# EAGLE design otl (EAGLE 7.7.0)
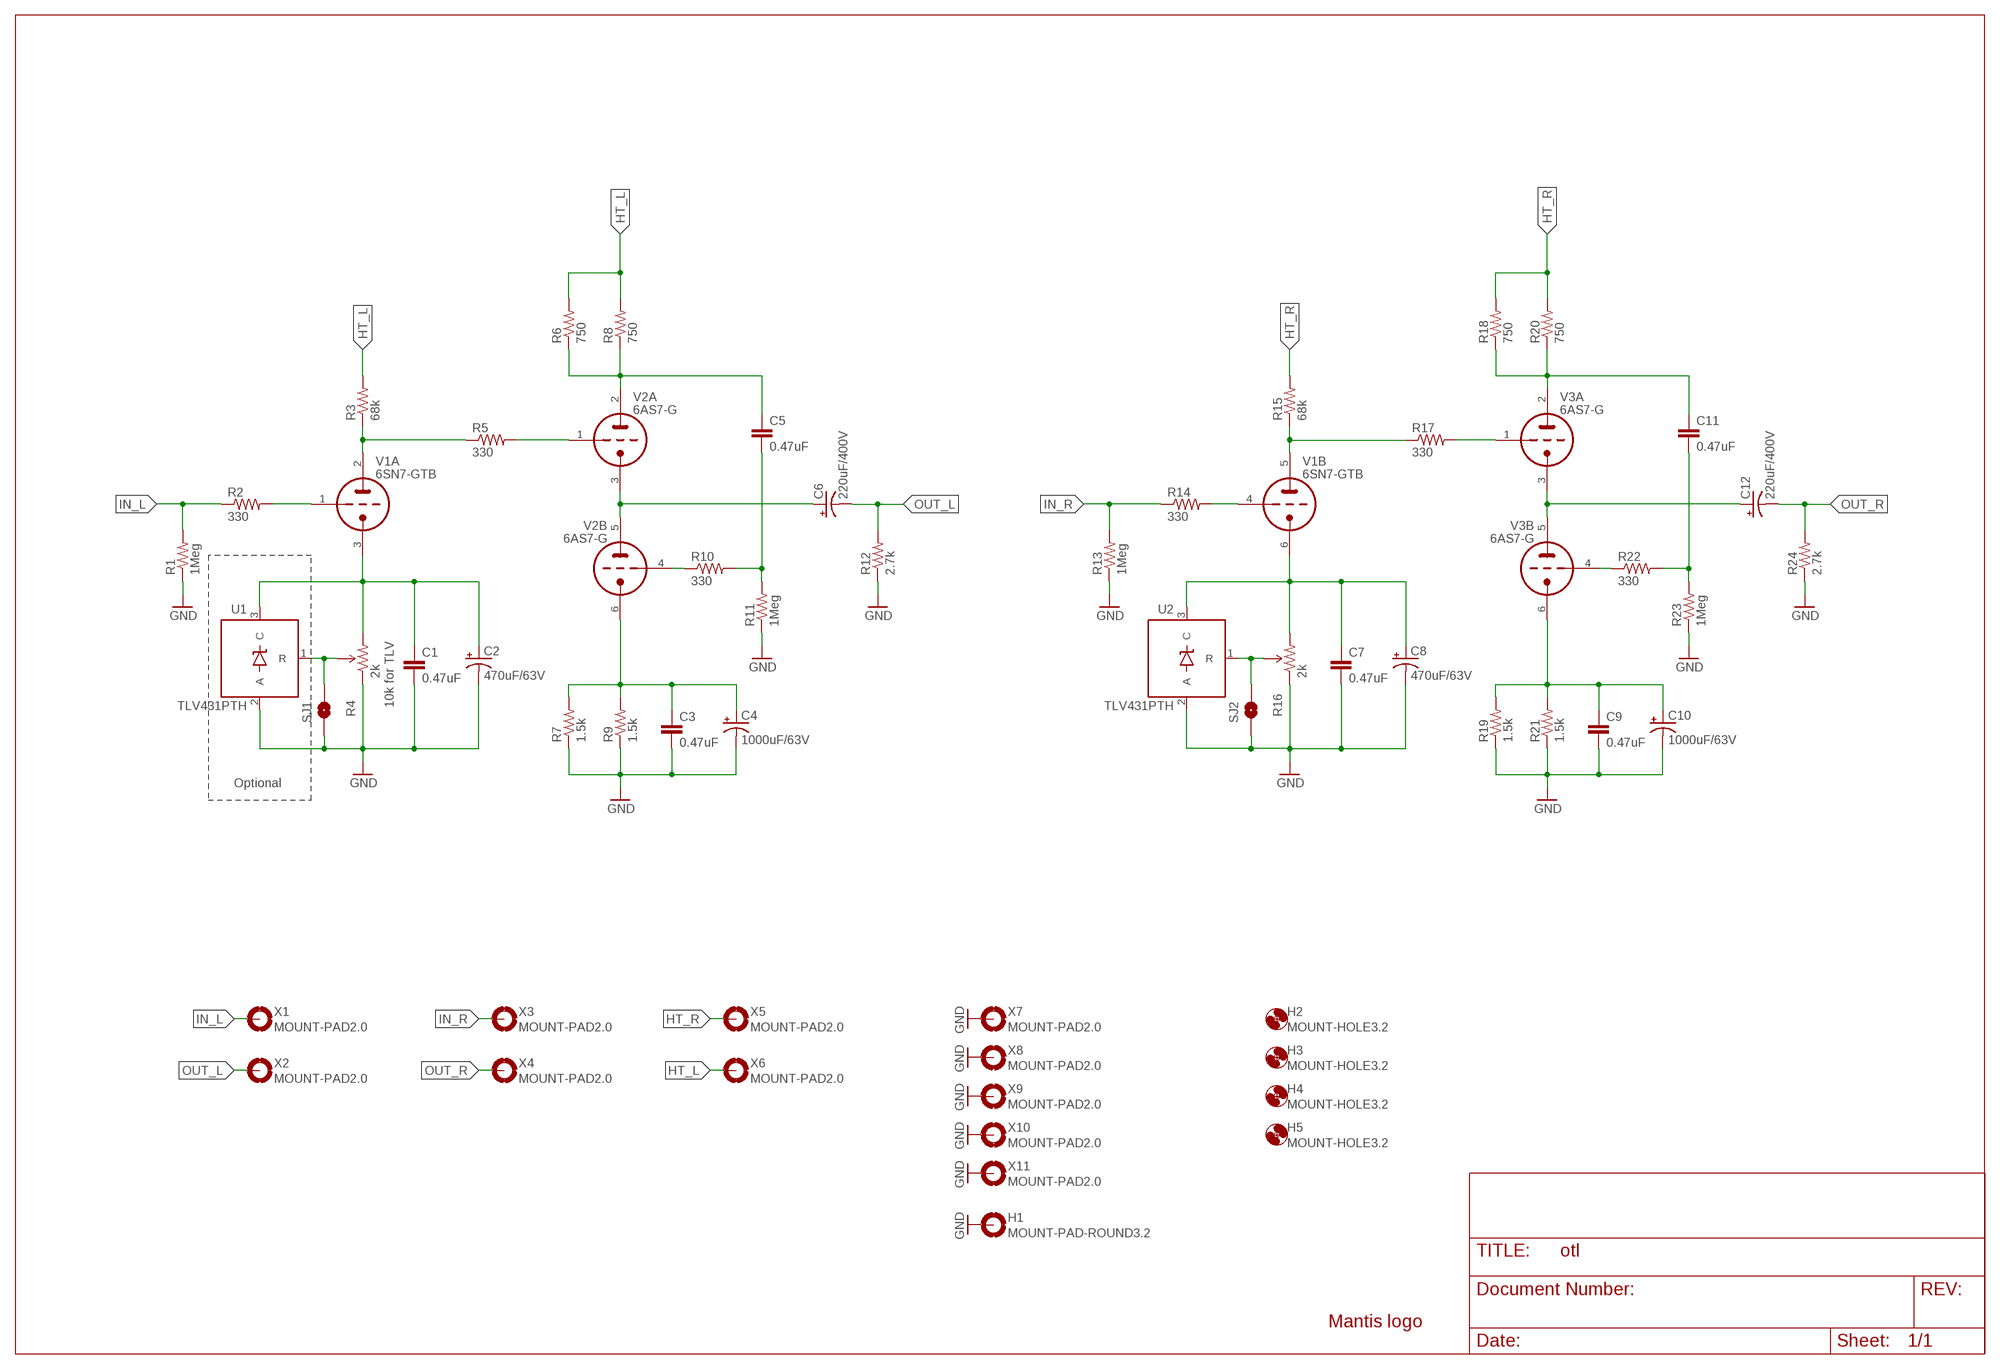
[diagram p0: schematic, sheet 1]

## Parts
C1  0.47uF  C5/5.5  [C5B5.5]
C2  470uF/63V  CAP_POLPTH-16/7.5  [CPOL-RADIAL-16/7.5]
C3  0.47uF  C5/5.5  [C5B5.5]
C4  1000uF/63V  CAP_POLPTH-16/7.5  [CPOL-RADIAL-16/7.5]
C5  0.47uF  C22/11  [C22.5B11]
C6  220uF/400V  CAP_POLPTH-25/12.5  [CPOL-RADIAL-25/12.5]
C7  0.47uF  C5/5.5  [C5B5.5]
C8  470uF/63V  CAP_POLPTH-16/7.5  [CPOL-RADIAL-16/7.5]
C9  0.47uF  C5/5.5  [C5B5.5]
C10  1000uF/63V  CAP_POLPTH-16/7.5  [CPOL-RADIAL-16/7.5]
C11  0.47uF  C22/11  [C22.5B11]
C12  220uF/400V  CAP_POLPTH-25/12.5  [CPOL-RADIAL-25/12.5]
H1  MOUNT-PAD-ROUND3.2  [3,2-PAD]
H2  MOUNT-HOLE3.2  [3,2]
H3  MOUNT-HOLE3.2  [3,2]
H4  MOUNT-HOLE3.2  [3,2]
H5  MOUNT-HOLE3.2  [3,2]
LOGO1  LOGO-MANTIS  [LOGO-MANTIS]
R1  1Meg  RESISTORPTH-1/4W  [AXIAL-0.4]
R2  330  RESISTORPTH-1/4W  [AXIAL-0.4]
R3  68k  RESISTORPTH-2W  [AXIAL-0.8]
R4  2k  TRIMPOT3362U-2  [3362U-2]
R5  330  RESISTORPTH-1/4W  [AXIAL-0.4]
R6  750  RESISTORPTH-2W  [AXIAL-0.8]
R7  1.5k  RESISTORPTH-2W  [AXIAL-0.8]
R8  750  RESISTORPTH-2W  [AXIAL-0.8]
R9  1.5k  RESISTORPTH-2W  [AXIAL-0.8]
R10  330  RESISTORPTH-1/4W  [AXIAL-0.4]
R11  1Meg  RESISTORPTH-1/4W  [AXIAL-0.4]
R12  2.7k  RESISTORPTH-1/4W  [AXIAL-0.4]
R13  1Meg  RESISTORPTH-1/4W  [AXIAL-0.4]
R14  330  RESISTORPTH-1/4W  [AXIAL-0.4]
R15  68k  RESISTORPTH-2W  [AXIAL-0.8]
R16  2k  TRIMPOT3362U-2  [3362U-2]
R17  330  RESISTORPTH-1/4W  [AXIAL-0.4]
R18  750  RESISTORPTH-2W  [AXIAL-0.8]
R19  1.5k  RESISTORPTH-2W  [AXIAL-0.8]
R20  750  RESISTORPTH-2W  [AXIAL-0.8]
R21  1.5k  RESISTORPTH-2W  [AXIAL-0.8]
R22  330  RESISTORPTH-1/4W  [AXIAL-0.4]
R23  1Meg  RESISTORPTH-1/4W  [AXIAL-0.4]
R24  2.7k  RESISTORPTH-1/4W  [AXIAL-0.4]
SJ1  SOLDERJUMPERNO-LARGE  [SJ_2S-NO-LARGE]
SJ2  SOLDERJUMPERNO-LARGE  [SJ_2S-NO-LARGE]
U1  TLV431PTH  [TO-92]
U2  TLV431PTH  [TO-92]
V1  6SN7-GTB  6SN7GT-P-NHOUTLET  [OKTAL-OUTLET]
V2  6AS7-G  6AS7G-P-NHOUTLET  [OKTAL-OUTLET]
V3  6AS7-G  6AS7G-P-NHOUTLET  [OKTAL-OUTLET]
X1  MOUNT-PAD2.0  [2.0-PAD]
X2  MOUNT-PAD2.0  [2.0-PAD]
X3  MOUNT-PAD2.0  [2.0-PAD]
X4  MOUNT-PAD2.0  [2.0-PAD]
X5  MOUNT-PAD2.0  [2.0-PAD]
X6  MOUNT-PAD2.0  [2.0-PAD]
X7  MOUNT-PAD2.0  [2.0-PAD]
X8  MOUNT-PAD2.0  [2.0-PAD]
X9  MOUNT-PAD2.0  [2.0-PAD]
X10  MOUNT-PAD2.0  [2.0-PAD]
X11  MOUNT-PAD2.0  [2.0-PAD]

## Nets
GND: C1.2 C2.2(-) C3.2 C4.2(-) C7.2 C8.2(-) C9.2 C10.2(-) H1.B3,2(MOUNT) R1.P$1 R4.1(CCW) R7.P$1 R9.P$1 R11.P$1 R12.P$1 R13.P$1 R16.1(CCW) R19.P$1 R21.P$1 R23.P$1 R24.P$1 SJ1.1 SJ2.1 U1.2(A) U2.2(A) X7.P$1(MOUNT) X8.P$1(MOUNT) X9.P$1(MOUNT) X10.P$1(MOUNT) X11.P$1(MOUNT)
HT_L: R3.P$2 R6.P$2 R8.P$2 X6.P$1(MOUNT)
HT_R: R15.P$2 R18.P$2 R20.P$2 X5.P$1(MOUNT)
IN_L: R1.P$2 R2.P$1 X1.P$1(MOUNT)
IN_R: R13.P$2 R14.P$1 X3.P$1(MOUNT)
N$1: C5.1 R6.P$1 R8.P$1 V2.2(A:TA)
N$2: C11.1 R18.P$1 R20.P$1 V3.2(A:TA)
N$3: R10.P$1 V2.4(B:TG)
N$4: C1.1 C2.1(+) R4.3(CW) U1.3(C) V1.3(A:TK)
N$5: C3.1 C4.1(+) R7.P$2 R9.P$2 V2.6(B:TK)
N$6: C5.2 R10.P$2 R11.P$2
N$8: R5.P$2 V2.1(A:TG)
N$9: R3.P$1 R5.P$1 V1.2(A:TA)
N$10: R22.P$1 V3.4(B:TG)
N$11: C6.1(+) V2.3(A:TK) V2.5(B:TA)
N$12: C9.1 C10.1(+) R19.P$2 R21.P$2 V3.6(B:TK)
N$13: C11.2 R22.P$2 R23.P$2
N$14: R17.P$2 V3.1(A:TG)
N$15: R16.2(WIPER) SJ2.2 U2.1(R)
N$16: C7.1 C8.1(+) R16.3(CW) U2.3(C) V1.6(B:TK)
N$17: R15.P$1 R17.P$1 V1.5(B:TA)
N$18: C12.1(+) V3.3(A:TK) V3.5(B:TA)
N$19: R2.P$2 V1.1(A:TG)
N$20: R4.2(WIPER) SJ1.2 U1.1(R)
N$21: R14.P$2 V1.4(B:TG)
OUT_L: C6.2(-) R12.P$2 X2.P$1(MOUNT)
OUT_R: C12.2(-) R24.P$2 X4.P$1(MOUNT)

## Notes on the sheet
- 10k for TLV
- Optional

## Library data of the parts
C1 C3 C5 C7 C9 C11 = capacitor-wima:C: CAPACITOR naming: grid - package width
C2 C4 C6 C8 C10 C12 = my-cap:CAP_POL: Capacitor Polarized These are standard SMD and PTH capacitors. Normally 10uF, 47uF, and 100uF in electrolytic and tantalum varieties. Always verify the external diameter of the through hole cap, it varies with capacity, voltage, and manufacturer. The EIA devices should be standard.
H1 = holes:MOUNT-PAD-ROUND: MOUNTING PAD, round
H2-H5 = holes:MOUNT-HOLE: MOUNTING HOLE with drill center marker
LOGO1 = my:LOGO-MANTIS: Mantis logo
R1-R3 R5-R15 R17-R24 = my-res:RESISTOR: Resistor Basic schematic elements and footprints for 0603, 1206, and PTH resistors.
R4 R16 = SparkFun-Electromechanical:TRIMPOT: Various small potentiometers for "set-and-forget" applications
SJ1 SJ2 = my-conn:SOLDERJUMPER: Solder Jumper Standard SMD solder jumper. Used to automate production. Two varients : Normally Open and Normally Closed are the same, but have different paste layers. NC will have a large amount of paste and should jumper during reflow.
U1 U2 = my-reg:TLV431: Precision Programmable Reference
V1 = my-tubes:6SN7GT-P-NH
V2 V3 = my-tubes:6AS7G-P-NH
X1-X11 = my-conn:MOUNT-PAD

## Board
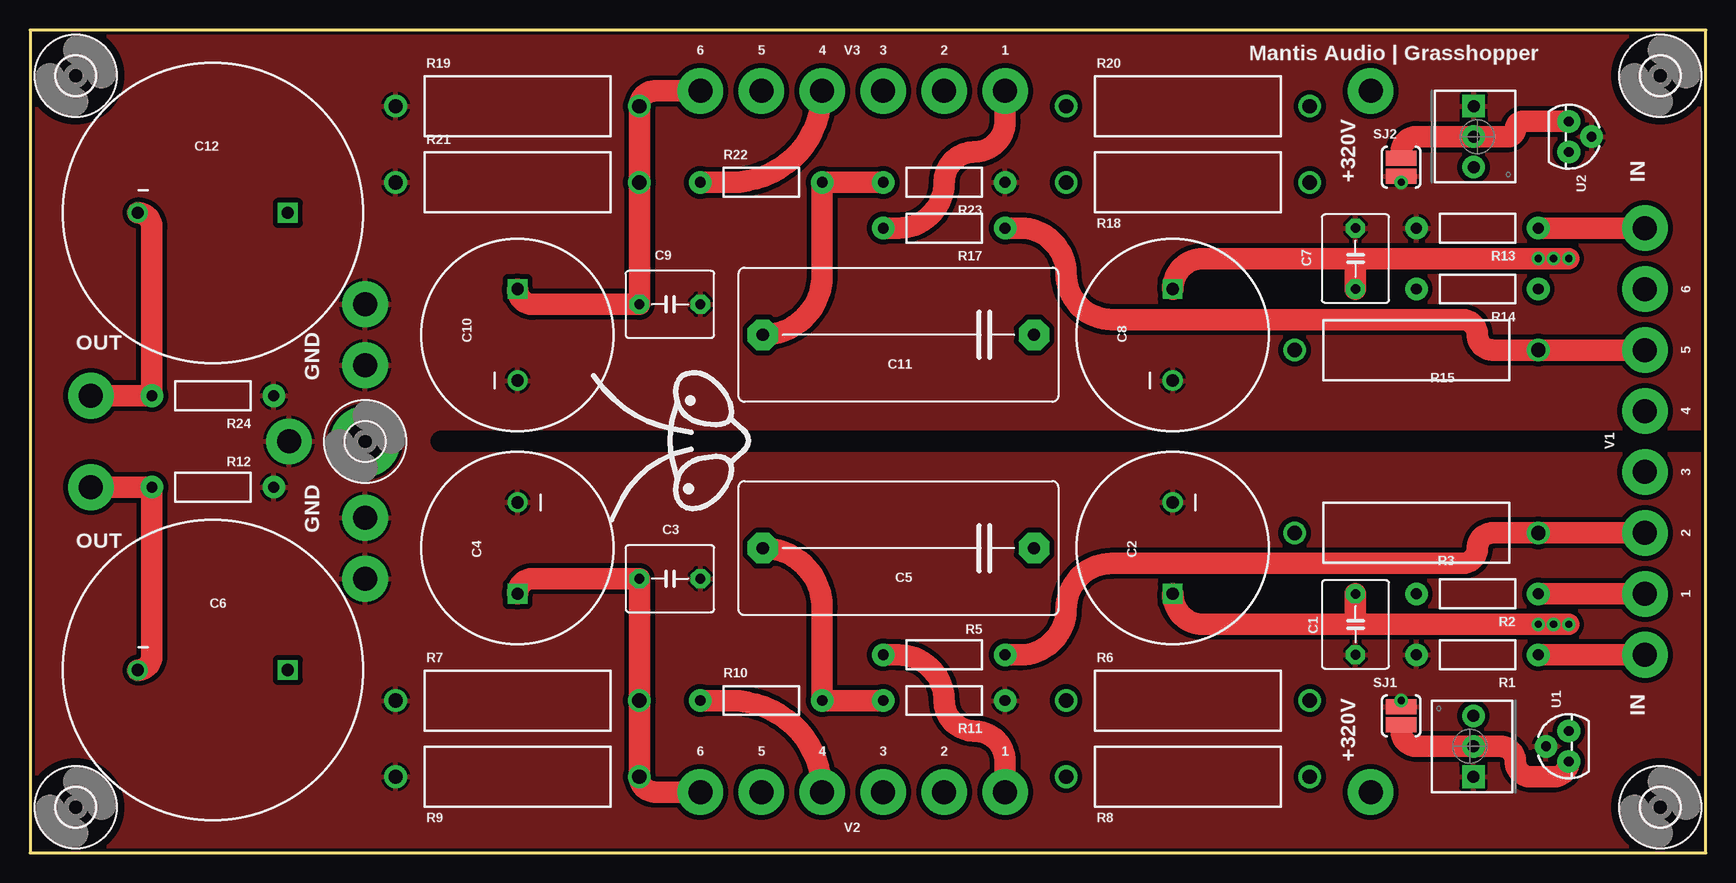
[diagram p1: board, top side]
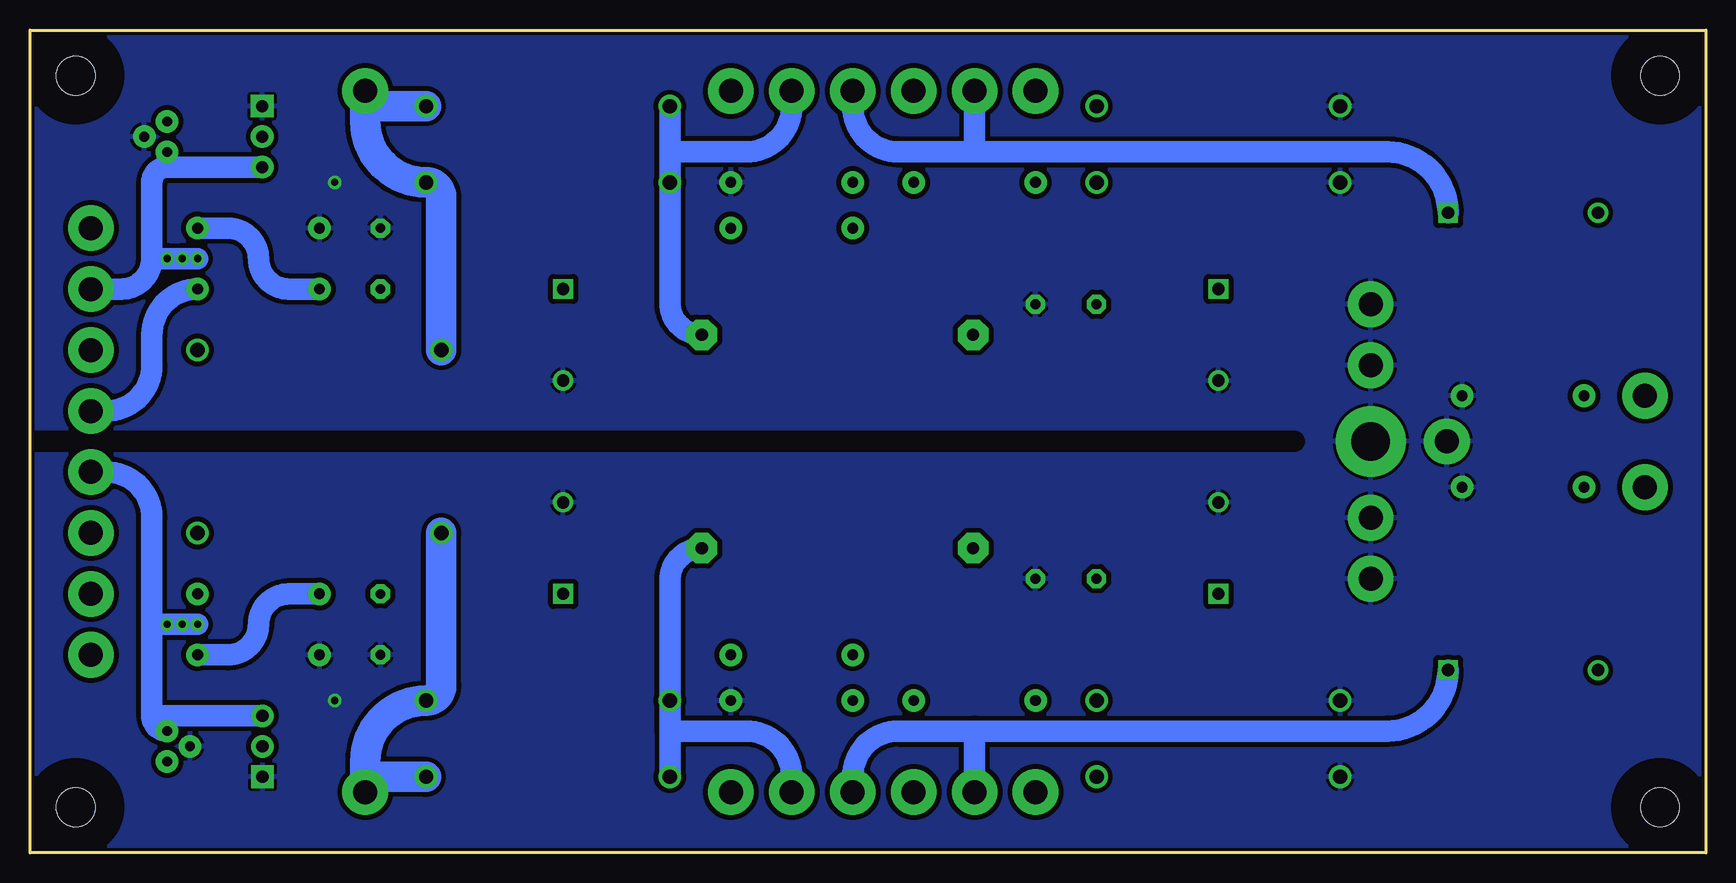
[diagram p2: board, bottom side, seen from below]

Size 139.7 x 68.58 mm. Coordinates in mm from the lower left corner, seen from the top.
Outline: 0,0 139.7,0 139.7,68.58 0,68.58 0,0
Copper layers (1*16): Top 0.035mm / dielectric 1.5mm / Bottom 0.035mm
Design rules "SeeedStudio_2layer_DRU_no_angle_20140221 *": minimum track width 12mil, minimum drill 12mil, track to track 16mil, track to pad 16mil, pad to pad 12mil, via to via 12mil, smd to smd 0mil, copper to edge 10mil, drill to drill 10mil, minimum pad ring 12mil, minimum via ring 10mil, stop-mask expansion 2mil, vias tented up to drill 100mil, thermal gap 10mil
tRestrict: 1 lines
bRestrict: 1 lines

### Footprints (pad centres in the part's own frame; a part is rotated, then mirrored left to right if it is on the bottom)
C5B5.5 = drill 0.813 pad 1.6 octagon: 1 -2.54,0; 2 2.54,0
CPOL-RADIAL-16/7.5 = drill 1.016 pad 1.651 square: 1 3.81,0 | drill 1.016 pad 1.676: 2 -3.81,0
C22.5B11 = drill 1.016 pad 2.54 octagon: 1 -11.303,0; 2 11.303,0
CPOL-RADIAL-25/12.5 = drill 1.016 pad 1.651 square: 1 6.25,0 | drill 1.016 pad 1.676: 2 -6.25,0
3,2-PAD = drill 3.2 pad 5.842: B3,2 0,0
3,2 = hole 3.2: 0,0
AXIAL-0.4 = drill 0.9 pad 1.88: P$1 -5.08,0; P$2 5.08,0
AXIAL-0.8 = drill 1.2 pad 1.88: P$1 -10.16,0; P$2 10.16,0
3362U-2 = drill 1.016 pad 1.88 square: 1 -2.54,-0.305 | drill 1.016 pad 1.88: 2 0,-0.305; 3 2.54,-0.305
SJ_2S-NO-LARGE = smd 1.27 x 2.54: 1 -0.75,0; 2 0.75,0
TO-92 = drill 0.813 pad 1.88: 1 -1.27,0; 2 0,1.905; 3 1.27,0
OKTAL-OUTLET = drill 2 pad 3.81: 1 -12.7,0; 2 -7.62,0; 3 -2.54,0; 4 2.54,0; 5 7.62,0; 6 12.7,0
2.0-PAD = drill 2 pad 3.81: P$1 0,0

### Placement (x,y rotation side)
C1  110.49,19.05 270 top
C2  95.25,25.4 270 top
C3  53.34,22.86 0 top
C4  40.64,25.4 270 top
C5  72.39,25.4 180 top
C6  15.24,15.24 0 top
C7  110.49,49.53 90 top
C8  95.25,43.18 90 top
C9  53.34,45.72 0 top
C10  40.64,43.18 90 top
C11  72.39,43.18 180 top
C12  15.24,53.34 0 top
H1  27.94,34.29 0 top
H2  135.89,64.77 0 top
H3  135.89,3.81 0 top
H4  3.81,3.81 0 top
H5  3.81,64.77 0 top
LOGO1  53.34,34.29 90 top
R1  120.65,16.51 0 top
R2  120.65,21.59 0 top
R3  115.57,26.67 180 top
R4  120.02,8.89 90 top
R5  76.2,16.51 180 top
R6  96.52,12.7 0 top
R7  40.64,12.7 0 top
R8  96.52,6.35 0 top
R9  40.64,6.35 0 top
R10  60.96,12.7 0 top
R11  76.2,12.7 180 top
R12  15.24,30.48 180 top
R13  120.65,52.07 0 top
R14  120.65,46.99 0 top
R15  115.57,41.91 180 top
R16  120.65,59.69 270 top
R17  76.2,52.07 180 top
R18  96.52,55.88 0 top
R19  40.64,62.23 0 top
R20  96.52,62.23 0 top
R21  40.64,55.88 0 top
R22  60.96,55.88 0 top
R23  76.2,55.88 180 top
R24  15.24,38.1 180 top
SJ1  114.3,11.43 270 top
SJ2  114.3,57.15 90 top
U1  128.27,8.89 90 top
U2  128.27,59.69 270 top
V1  134.62,34.29 90 top
V2  68.58,5.08 180 top
V3  68.58,63.5 180 top
X1  134.62,16.51 0 top
X2  5.08,30.48 0 top
X3  134.62,52.07 0 top
X4  5.08,38.1 0 top
X5  111.76,63.5 0 top
X6  111.76,5.08 0 top
X7  27.94,22.86 0 top
X8  27.94,45.72 0 top
X9  21.59,34.29 0 top
X10  27.94,27.94 0 top
X11  27.94,40.64 0 top

### Tracks (layer width: path | path; a pad name or v marks a point on that pad's centre or on a via)
GND  (via drill 0.6)
  other vias: 114.3,55.88 114.3,12.7
  pour Bottom: 0,68.58 139.7,68.58 139.7,0 0,0
  pour Top: 0,68.58 139.7,68.58 139.7,0 0,0
HT_L
  Bottom 2.54: X6.P$1 111.76,6.35 | R8.P$2 111.76,6.35 | R3.P$2 105.41,13.97 arc90 R6.P$2 arc-90 111.76,7.62 111.76,6.35
HT_R
  Bottom 2.54: X5.P$1 111.76,62.23 | R20.P$2 111.76,62.23 | R15.P$2 105.41,54.61 arc-90 R18.P$2 arc90 111.76,60.96 111.76,62.23
IN_L
  Top 1.778: X1.P$1 R1.P$2
  Bottom 1.778: R2.P$1 118.11,21.59 arc-90 120.65,19.05 arc90 123.19,16.51 R1.P$2
IN_R
  Top 1.778: X3.P$1 R13.P$2
  Bottom 1.778: R14.P$1 118.11,46.99 arc90 120.65,49.53 arc-90 123.19,52.07 R13.P$2
N$1
  Bottom 1.778: 86.36,10.16 80.01,10.16 arc90 76.2,6.35 V2.2 | 86.36,10.16 R6.P$1 86.36,22.73 arc90 C5.1 | 86.36,10.16 R8.P$1
N$2
  Bottom 1.778: C11.1 arc90 86.36,45.85 R18.P$1 86.36,58.42 | 86.36,58.42 R20.P$1 | 86.36,58.42 80.01,58.42 arc-90 76.2,62.23 V3.2
N$3
  Top 1.778: V2.4 arc90 58.42,12.7 R10.P$1
N$4  (via drill 0.6)
  Top 1.778: v128.27,19.05 v127,19.05 v125.73,19.05 110.49,19.05 | 110.49,19.05 97.79,19.05 arc-90 C2.1 | C1.1 110.49,19.05
  Bottom 1.778: U1.3 arc90 129.54,11.43 | 129.54,11.43 129.54,19.05 | 129.54,19.05 129.54,27.94 arc-90 133.35,31.75 V1.3 | R4.3 129.54,11.43 | 129.54,19.05 v128.27,19.05 v127,19.05 v125.73,19.05
N$5
  Top 1.778: C4.1 arc-90 41.91,22.86 C3.1 R7.P$2 R9.P$2 arc90 52.07,5.08 V2.6
N$6
  Top 1.778: R11.P$2 R10.P$2 66.04,20.45 arc90 C5.2
N$8
  Top 1.778: R5.P$2 72.39,16.51 arc-90 76.2,12.7 arc90 78.74,10.16 arc-90 81.28,7.62 V2.1
N$9
  Top 1.778: V1.2 R3.P$1 121.92,26.67 arc90 120.65,25.4 arc-90 119.38,24.13 90.17,24.13 arc90 86.36,20.32 arc-90 82.55,16.51 R5.P$1
N$10
  Top 1.778: R22.P$1 58.42,55.88 arc90 V3.4
N$11
  Bottom 1.778: 60.96,10.16 67.31,10.16 arc-90 71.12,6.35 V2.3 | 60.96,10.16 26.57,10.16 arc-90 C6.1 | V2.5 60.96,10.16
N$12
  Top 1.778: C10.1 arc90 41.91,45.72 C9.1 R21.P$2 R19.P$2 arc-90 52.07,63.5 V3.6
N$13
  Top 1.778: R23.P$2 R22.P$2 66.04,48.13 arc-90 C11.2
N$14
  Top 1.778: R17.P$2 72.39,52.07 arc90 76.2,55.88 arc-90 78.74,58.42 arc90 81.28,60.96 V3.1
N$15
  Top 1.27: SJ2.2 114.3,58.42
  Top 1.778: 114.3,58.42 arc-90 115.57,59.69 R16.2 123.19,59.69 arc90 123.83,60.33 arc-90 124.46,60.96 U2.1
N$16  (via drill 0.6)
  Top 1.778: v128.27,49.53 v127,49.53 v125.73,49.53 110.49,49.53 | 110.49,49.53 97.79,49.53 arc90 C8.1 | C7.1 110.49,49.53
  Bottom 1.778: V1.6 132.08,46.99 arc-90 129.54,49.53 | 129.54,49.53 129.54,55.88 arc90 128.27,57.15 | 128.27,57.15 R16.3 | U2.3 128.27,57.15 | 129.54,49.53 v128.27,49.53 v127,49.53 v125.73,49.53
N$17
  Top 1.778: V1.5 R15.P$1 121.92,41.91 arc-90 120.65,43.18 arc90 119.38,44.45 90.17,44.45 arc-90 86.36,48.26 arc90 82.55,52.07 R17.P$1
N$18
  Bottom 1.778: 60.96,58.42 67.31,58.42 arc90 71.12,62.23 V3.3 | 60.96,58.42 26.57,58.42 arc90 C12.1 | V3.5 60.96,58.42
N$19
  Top 1.778: V1.1 R2.P$2
N$20
  Top 1.27: SJ1.2 114.3,10.16
  Top 1.778: 114.3,10.16 arc90 115.57,8.89 R4.2 122.56,8.89 arc-90 123.83,7.62 arc90 125.09,6.35 127,6.35 arc90 U1.1
N$21
  Bottom 1.778: R14.P$2 arc-90 129.54,43.18 129.54,40.64 arc90 133.35,36.83 V1.4
OUT_L
  Top 1.778: X2.P$1 R12.P$2 10.16,16.41 arc-90 C6.2
OUT_R
  Top 1.778: X4.P$1 R24.P$2 10.16,52.17 arc90 C12.2

### Text on the board
tPlace: Mantis Audio | Grasshopper | +320V | IN | OUT | GND | GND | OUT | IN | +320V